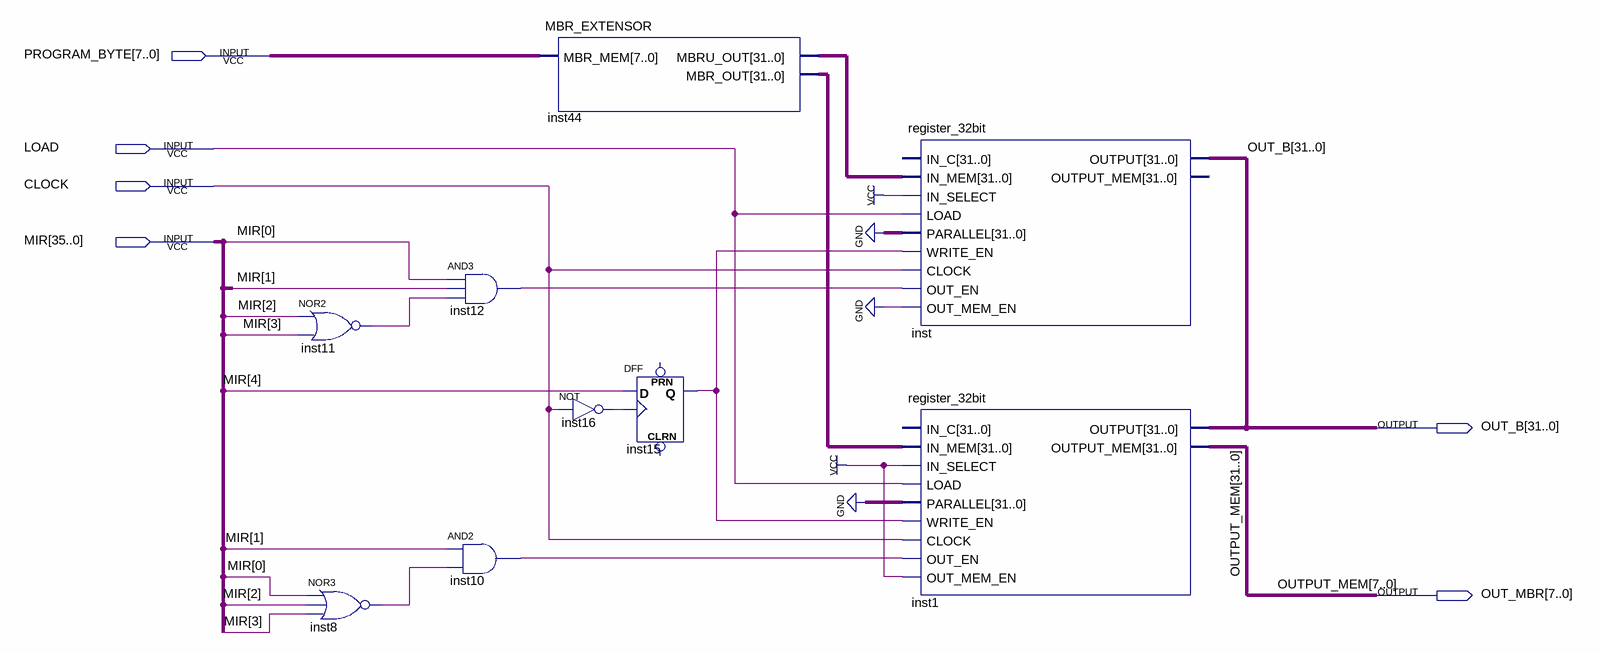
[diagram p0: schematic sheet]
// Quartus schematic MBR.bdf as structural Verilog: 9 symbols, 6 pins
module MBR (
  input  [7:0] PROGRAM_BYTE,
  input  LOAD,
  input  CLOCK,
  input  [35:0] MIR,
  output [31:0] OUT_B,
  output [7:0] OUT_MBR
);

  wire inst8_out, inst10_out, inst11_out, inst12_out, inst15_q, inst16_out;
  wire [31:0] inst44_mbr_out, inst44_mbru_out;
  wire [31:8] OUTPUT_MEM;

  nor inst11 (inst11_out, MIR[2], MIR[3]);
  nor inst8 (inst8_out, MIR[0], MIR[2], MIR[3]);
  and inst12 (inst12_out, MIR[0], MIR[1], inst11_out);
  and inst10 (inst10_out, MIR[1], inst8_out);
  MBR_EXTENSOR inst44 (.MBR_MEM(PROGRAM_BYTE), .MBRU_OUT(inst44_mbru_out), .MBR_OUT(inst44_mbr_out));
  not inst16 (inst16_out, CLOCK);
  DFF inst15 (.CLK(inst16_out), .D(MIR[4]), .Q(inst15_q));  // open: CLRN, PRN
  register_32bit inst (
    .IN_MEM(inst44_mbru_out), .IN_SELECT(1'b1), .LOAD(LOAD), .PARALLEL({32{1'b0}}), .WRITE_EN(inst15_q),
    .CLOCK(CLOCK), .OUT_EN(inst12_out), .OUT_MEM_EN(1'b0), .OUTPUT(OUT_B));  // open: IN_C, OUTPUT_MEM
  register_32bit inst1 (
    .IN_MEM(inst44_mbr_out), .IN_SELECT(1'b1), .LOAD(LOAD), .PARALLEL({32{1'b0}}), .WRITE_EN(inst15_q),
    .CLOCK(CLOCK), .OUT_EN(inst10_out), .OUT_MEM_EN(1'b1), .OUTPUT(OUT_B), .OUTPUT_MEM({OUTPUT_MEM, OUT_MBR}));  // open: IN_C

  // Other names for the same wires on the sheet: OUTPUT_MEM[7:0] = OUT_MBR
endmodule
